# EAGLE design mazeSolver (EAGLE 9.6.2)

## Sheet 1 of 4
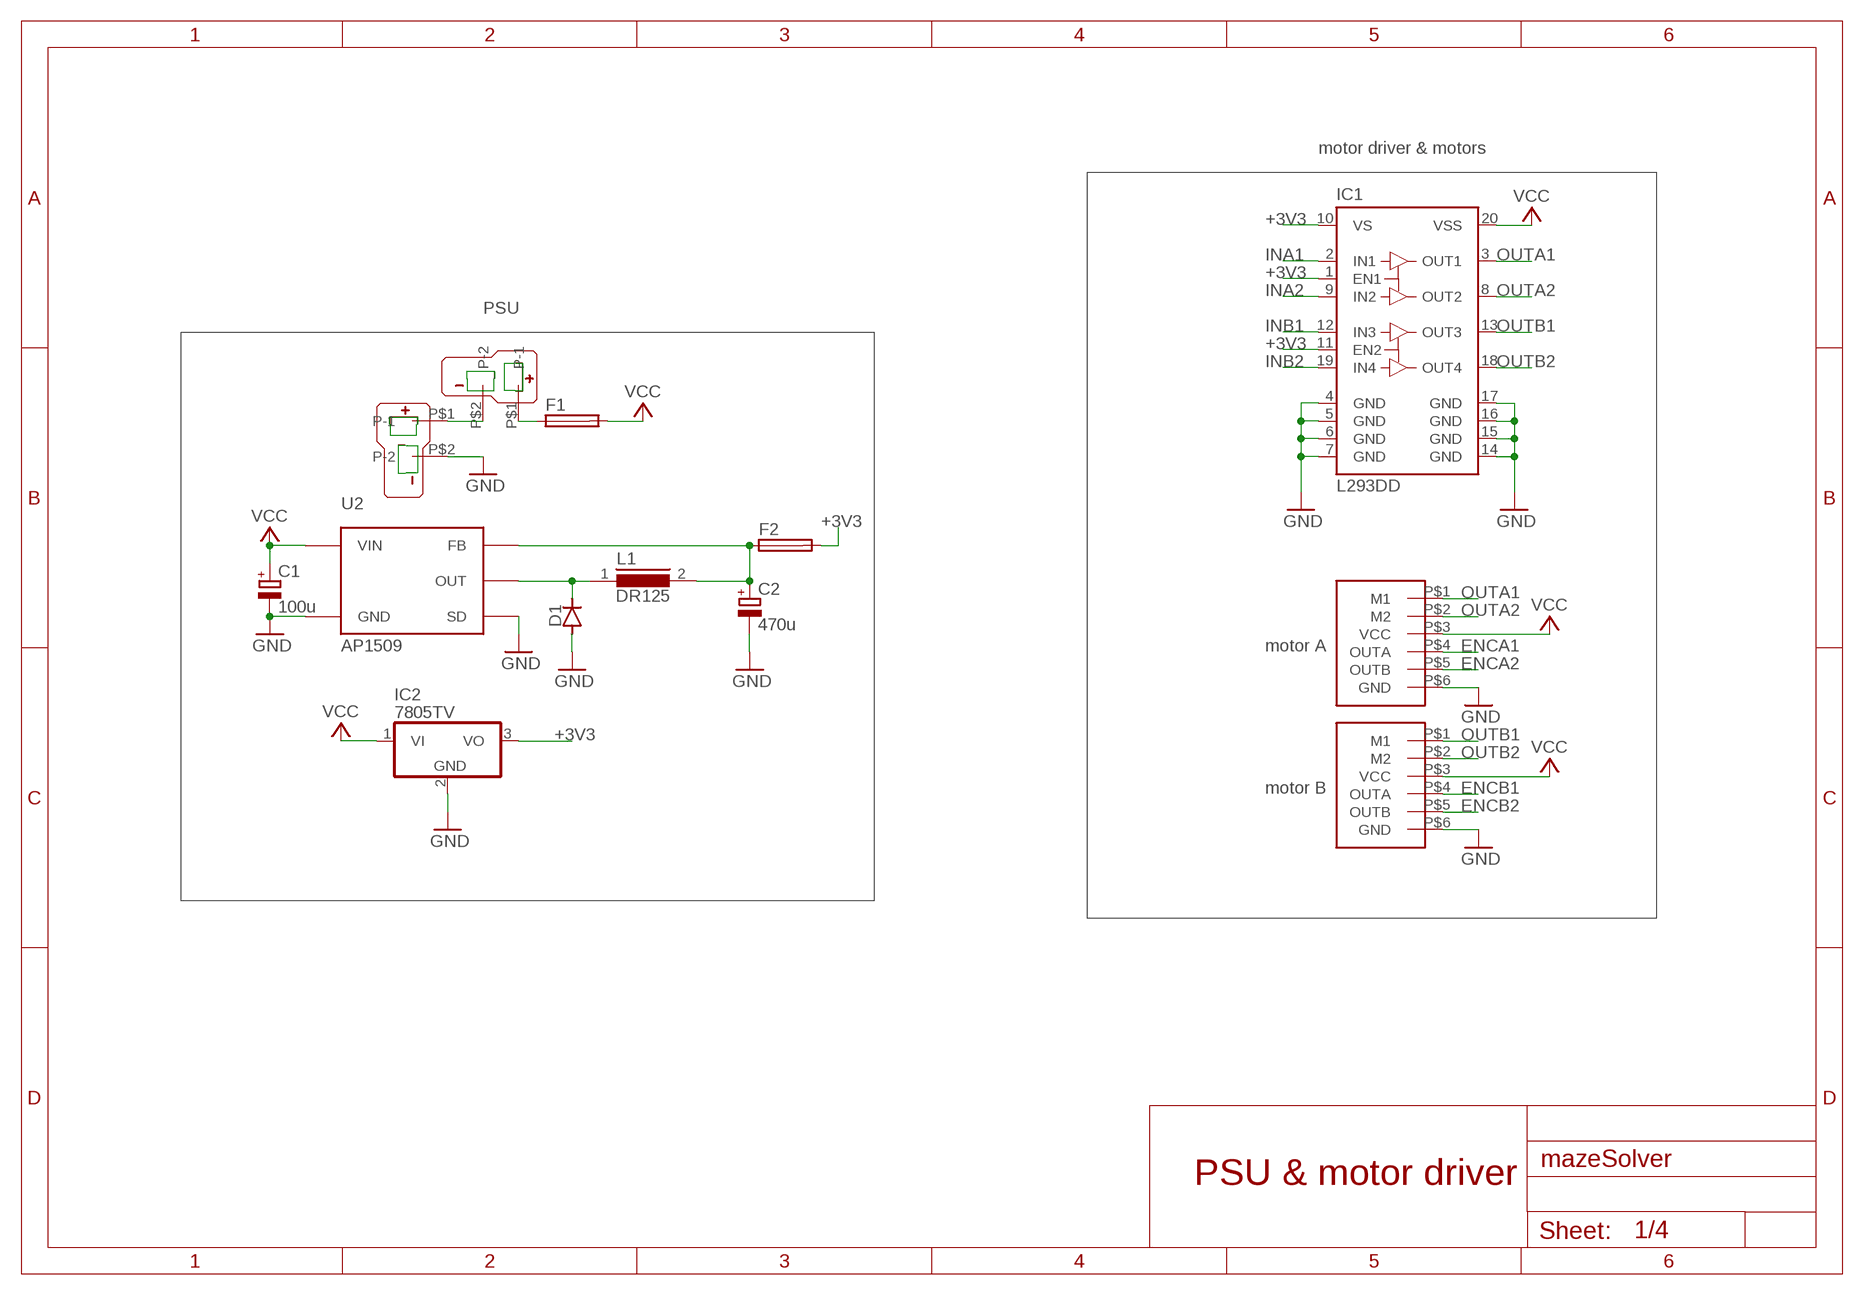
[diagram p0: schematic, sheet 1]

### Parts
C1  100u  CPOL-EU140CLH-0810  [140CLH-0810]
C2  470u  CPOL-EU140CLH-0810  [140CLH-0810]
D1  DIODE-DO214AC  [DO214AC]
F1  195591812  [C1812K]
F2  195591206  [C1206K]
IC1  L293DD  [SO20]
IC2  7805TV  [TO220V]
L1  DR125  [DR125]
U2  AP1509-SOP8L  [SOP-8L]
U$1  T-PLUG_CONNECTOR  [T_PLUG_CONNECTOR]
U$2  POLOLU_ENCODER  [POLOLU_ENCODER]
U$3  POLOLU_ENCODER  [POLOLU_ENCODER]
U$9  T-PLUG_CONNECTOR  [T_PLUG_CONNECTOR]

### Nets
+3V3: F2.2 IC1.1(EN1) IC1.10(VS) IC1.11(EN2) IC2.3(VO) ; also sheet 2,3
ENCA1: U$2.P$4(OUTA) ; also sheet 2
ENCA2: U$2.P$5(OUTB) ; also sheet 2
ENCB1: U$3.P$4(OUTA) ; also sheet 2
ENCB2: U$3.P$5(OUTB) ; also sheet 2
GND: C1.- C2.- D1.A IC1.4(GND) IC1.5(GND) IC1.6(GND) IC1.7(GND) IC1.14(GND) IC1.15(GND) IC1.16(GND) IC1.17(GND) IC2.2(GND) U2.4(SD) U2.5(GND) U2.6(GND) U2.7(GND) U2.8(GND) U$1.P$2(P-2) U$2.P$6(GND) U$3.P$6(GND) ; also sheet 2,3
INA1: IC1.2(IN1) ; also sheet 2
INA2: IC1.9(IN2) ; also sheet 2
INB1: IC1.12(IN3) ; also sheet 2
INB2: IC1.19(IN4) ; also sheet 2
N$3: D1.C L1.1 U2.2(OUT)
N$17: U$1.P$1(P-1) U$9.P$2(P-2)
N$22: F1.1 U$9.P$1(P-1)
N$24: C2.+ F2.1 L1.2 U2.3(FB)
OUTA1: IC1.3(OUT1) U$2.P$1(M1)
OUTA2: IC1.8(OUT2) U$2.P$2(M2)
OUTB1: IC1.13(OUT3) U$3.P$1(M1)
OUTB2: IC1.18(OUT4) U$3.P$2(M2)
VCC: C1.+ F1.2 IC1.20(VSS) IC2.1(VI) U2.1(VIN) U$2.P$3(VCC) U$3.P$3(VCC)

### Notes on the sheet
- motor driver & motors
- PSU
- motor A
- motor B
- PSU & motor driver

## Sheet 2 of 4
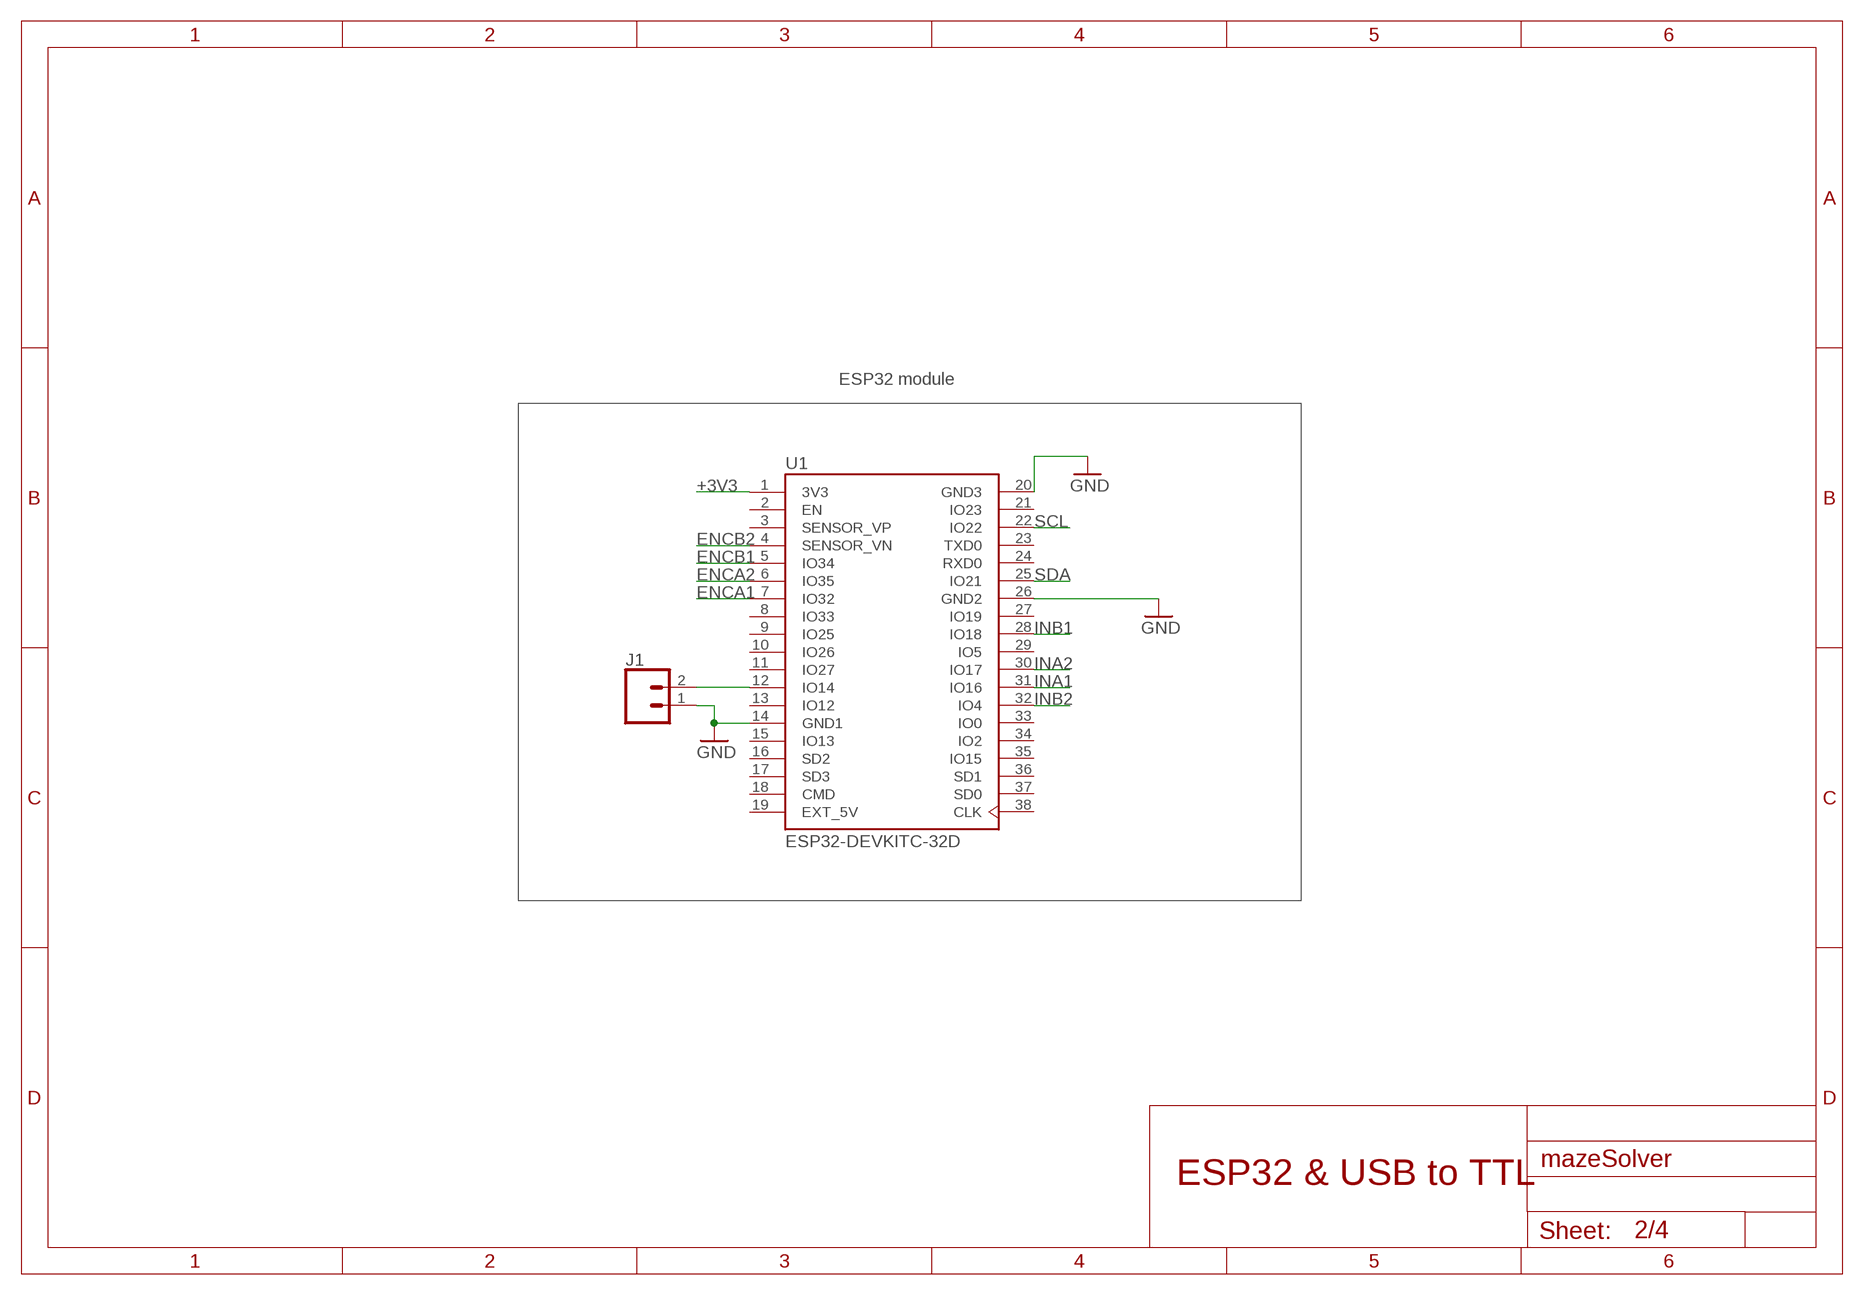
[diagram p1: schematic, sheet 2]

### Parts
J1  CONN_02  [1X02]
U1  ESP32-DEVKITC-32D  [MODULE_ESP32-DEVKITC-32D]

### Nets
+3V3: U1.1(3V3) ; also sheet 1,3
ENCA1: U1.7(IO32) ; also sheet 1
ENCA2: U1.6(IO35) ; also sheet 1
ENCB1: U1.5(IO34) ; also sheet 1
ENCB2: U1.4(SENSOR_VN) ; also sheet 1
GND: J1.1 U1.14(GND1) U1.20(GND3) U1.26(GND2) ; also sheet 1,3
INA1: U1.31(IO16) ; also sheet 1
INA2: U1.30(IO17) ; also sheet 1
INB1: U1.28(IO18) ; also sheet 1
INB2: U1.32(IO4) ; also sheet 1
N$19: J1.2 U1.12(IO14)
SCL: U1.22(IO22) ; also sheet 3
SDA: U1.25(IO21) ; also sheet 3
Unconnected: U1.2(EN) U1.3(SENSOR_VP) U1.8(IO33) U1.9(IO25) U1.10(IO26) U1.11(IO27) U1.13(IO12) U1.15(IO13) U1.16(SD2) U1.17(SD3) U1.18(CMD) U1.21(IO23) U1.23(TXD0) U1.24(RXD0) U1.27(IO19) U1.29(IO5) U1.33(IO0) U1.34(IO2) U1.35(IO15) U1.36(SD1) U1.37(SD0) U1.38(CLK)

### Notes on the sheet
- ESP32 module
- ESP32 & USB to TTL

## Sheet 3 of 4
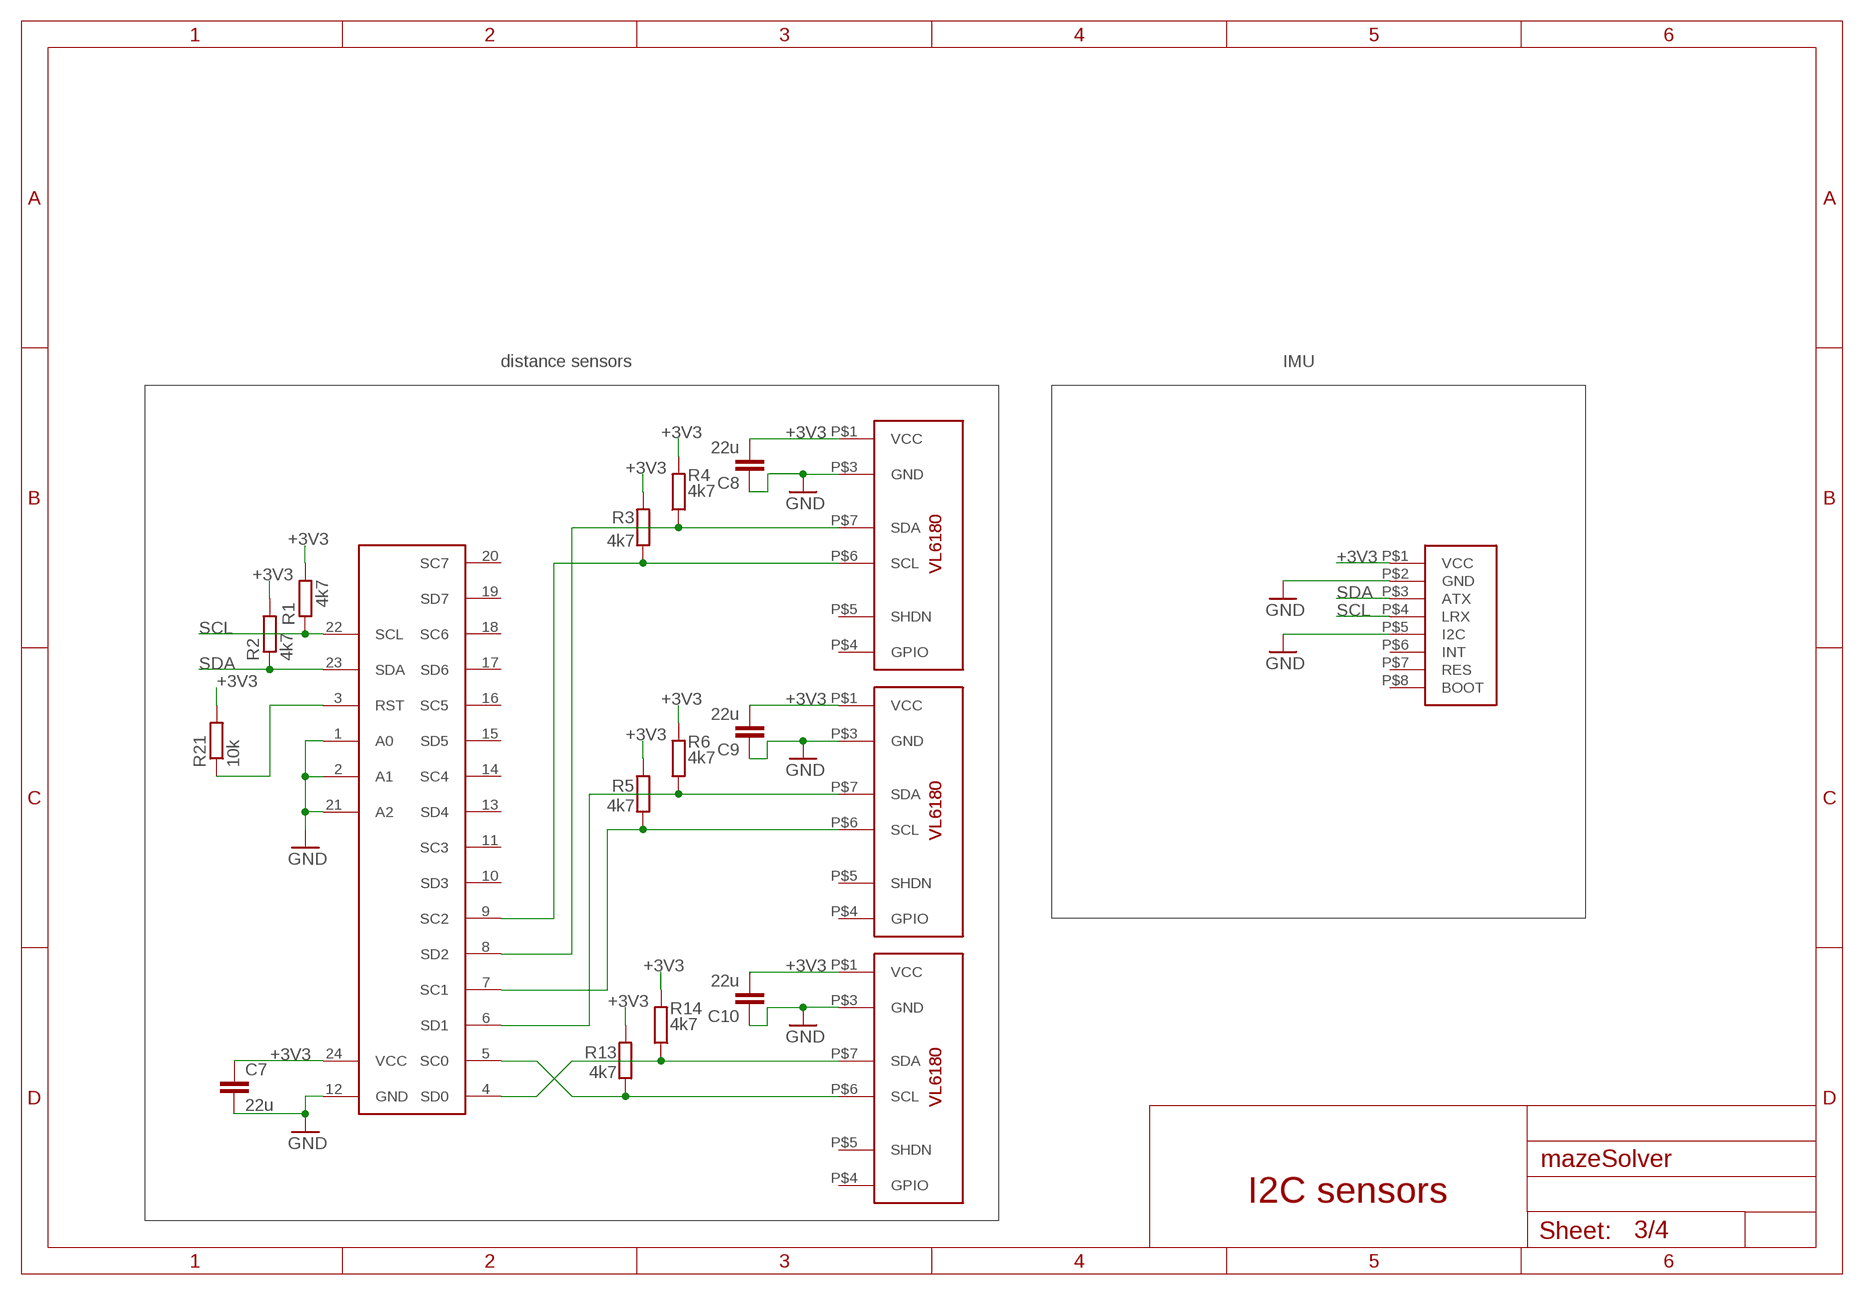
[diagram p2: schematic, sheet 3]

### Parts
C7  22u  C-EUC1206  [C1206]
C8  22u  C-EUC1206  [C1206]
C9  22u  C-EUC1206  [C1206]
C10  22u  C-EUC1206  [C1206]
R1  4k7  R-EU_R1206  [R1206]
R2  4k7  R-EU_R1206  [R1206]
R3  4k7  R-EU_R1206  [R1206]
R4  4k7  R-EU_R1206  [R1206]
R5  4k7  R-EU_R1206  [R1206]
R6  4k7  R-EU_R1206  [R1206]
R13  4k7  R-EU_R1206  [R1206]
R14  4k7  R-EU_R1206  [R1206]
R21  10k  R-EU_R1206  [R1206]
U$4  TDA9548  [SOIC24L]
U$5  VL6180X  [VL6180X]
U$6  VL6180X  [VL6180X]
U$7  VL6180X  [VL6180X]
U$8  BNO055  [BNO055]

### Nets
+3V3: C7.1 C8.1 C9.1 C10.1 R1.2 R2.2 R3.2 R4.2 R5.2 R6.2 R13.2 R14.2 R21.2 U$4.24(VCC) U$5.P$1(VCC) U$6.P$1(VCC) U$7.P$1(VCC) U$8.P$1(VCC) ; also sheet 1,2
GND: C7.2 C8.2 C9.2 C10.2 U$4.1(A0) U$4.2(A1) U$4.12(GND) U$4.21(A2) U$5.P$3(GND) U$6.P$3(GND) U$7.P$3(GND) U$8.P$2(GND) U$8.P$5(I2C) ; also sheet 1,2
N$1: R13.1 U$4.5(SC0) U$7.P$6(SCL)
N$2: R14.1 U$4.4(SD0) U$7.P$7(SDA)
N$4: R6.1 U$4.6(SD1) U$6.P$7(SDA)
N$5: R5.1 U$4.7(SC1) U$6.P$6(SCL)
N$6: R4.1 U$4.8(SD2) U$5.P$7(SDA)
N$7: R3.1 U$4.9(SC2) U$5.P$6(SCL)
N$25: R21.1 U$4.3(RST)
SCL: R1.1 U$4.22(SCL) U$8.P$4(LRX) ; also sheet 2
SDA: R2.1 U$4.23(SDA) U$8.P$3(ATX) ; also sheet 2
Unconnected: U$4.10(SD3) U$4.11(SC3) U$4.13(SD4) U$4.14(SC4) U$4.15(SD5) U$4.16(SC5) U$4.17(SD6) U$4.18(SC6) U$4.19(SD7) U$4.20(SC7) U$5.P$4(GPIO) U$5.P$5(SHDN) U$6.P$4(GPIO) U$6.P$5(SHDN) U$7.P$4(GPIO) U$7.P$5(SHDN) U$8.P$6(INT) U$8.P$7(RES) U$8.P$8(BOOT)

### Notes on the sheet
- distance sensors | IMU
- I2C sensors

## Sheet 4 of 4

## Power pins joined to a net without a drawn wire
EXT_5V: U1.19(EXT_5V)

## Library data of the parts
C1 = rcl:CPOL-EU: POLARIZED CAPACITOR, European symbol; MF: RUBYCON; MPN: 100YXF100MEFC12.5X20; OC_FARNELL: 1144642; SPICEPREFIX: C
C2 = rcl:CPOL-EU: POLARIZED CAPACITOR, European symbol; OC_FARNELL: unknown; SPICEPREFIX: C
C7-C10 = rcl:C-EU: CAPACITOR, European symbol; OC_FARNELL: unknown; SPICEPREFIX: C
D1 = diode:DIODE-: DIODE; OC_FARNELL: unknown
F1 F2 = polyfuse:19559: FUSE HOLDER TR5, Wickmann
IC1 = st-microelectronics:L293DD: PUSH-PULL FOUR CHANNEL DRIVER WITH DIODES Source: http://www.st.com/stonline/books/pdf/docs/1330.pdf; OC_FARNELL: unknown
IC2 = linear:78*: Positive VOLTAGE REGULATOR Source: http://cache.national.com/ds/LM/LM78L05.pdf http://www.fairchildsemi.com/ds/LM/LM7805.pdf; OC_FARNELL: unknown
J1 = SparkFun-Connectors:CONN_02: Multi connection point. Often used as Generic Header-pin footprint for 0.1 inch spaced/style header connections On any of the 0.1 inch spaced packages, you can populate with these: Break Away Headers - Straight <https://www.sparkfun.com/products/116> (PRT-00116) Break Away Male Headers - Right Angle <https://www.sparkfun.com/products/553> (PRT-00553) Female Headers <https://www.sparkfun.com/products/115> (PRT-00115) Break Away Headers - Machine Pin <https://www.sparkfun.com/products/117> (PRT-00117) Break Away Female Headers - Swiss Machine Pin <https://www.sparkfun.com/products/743> (PRT-00743) For SCREWTERMINALS and SPRING TERMINALS visit here: Screw Terimnals on SparkFun.com <https://www.sparkfun.com/search/results?term=Screw+Terminals> (5mm/3.5mm/2.54mm spacing) This device is also useful as a general connection point to wire up your design to another part of your project. Our various solder wires solder well into these plated through hole pads. Hook-Up Wire - Assortment (Stranded, 22 AWG) <https://www.sparkfun.com/products/11375> (PRT-11375) Hook-Up Wire - Assortment (Solid Core, 22 AWG) <https://www.sparkfun.com/products/11367> (PRT-11367) View the entire wire category on our website here <https://www.sparkfun.com/categories/141> Special notes: Molex polarized connector foot print use with: PRT-08233 with associated crimp pins and housings. 2.54_SCREWTERM for use with PRT-10571. 3.5mm Screw Terminal footprints for PRT-08084 5mm Screw Terminal footprints for use with PRT-08432; OC_FARNELL: unknown
L1 = inductors:DR125: High Power Density, High Efficiency, Shielded Inductors Source: coiltronics_dr_series.pdf; OC_FARNELL: unknown; SPICEPREFIX: L
R1-R6 R13 R14 R21 = rcl:R-EU_: RESISTOR, European symbol; OC_FARNELL: unknown; SPICEPREFIX: R
U1 = ESP32-DEVKITC-32D:ESP32-DEVKITC-32D: Eval Board For Esp-Wroom-32 Check prices <https://pricing.snapeda.com/parts/ESP32-DEVKITC-32D/Espressif%20Systems/view-part?ref=eda>; AVAILABILITY: Warning; DESCRIPTION: EVAL BOARD FOR ESP-WROOM-32; MF: Espressif Systems; MP: ESP32-DEVKITC-32D; PACKAGE: None; PRICE: None; PURCHASE-URL: https://pricing.snapeda.com/search/part/ESP32-DEVKITC-32D/?ref=eda
U2 = kanflo:AP1509: AP1509 150kHz 2A PWM Buck DC/DC Converter; OC_FARNELL: unknown
U$1 U$9 = con-T-plug:T-PLUG_CONNECTOR; OC_FARNELL: unknown
U$2 = pololu_encoder:POLOLU_ENCODER
U$3 = pololu_encoder:POLOLU_ENCODER; OC_FARNELL: unknown
U$4 = tda9548:TDA9548; OC_FARNELL: unknown
U$5-U$7 = vl6180x:VL6180X; OC_FARNELL: unknown
U$8 = bno055:BNO055

## Board
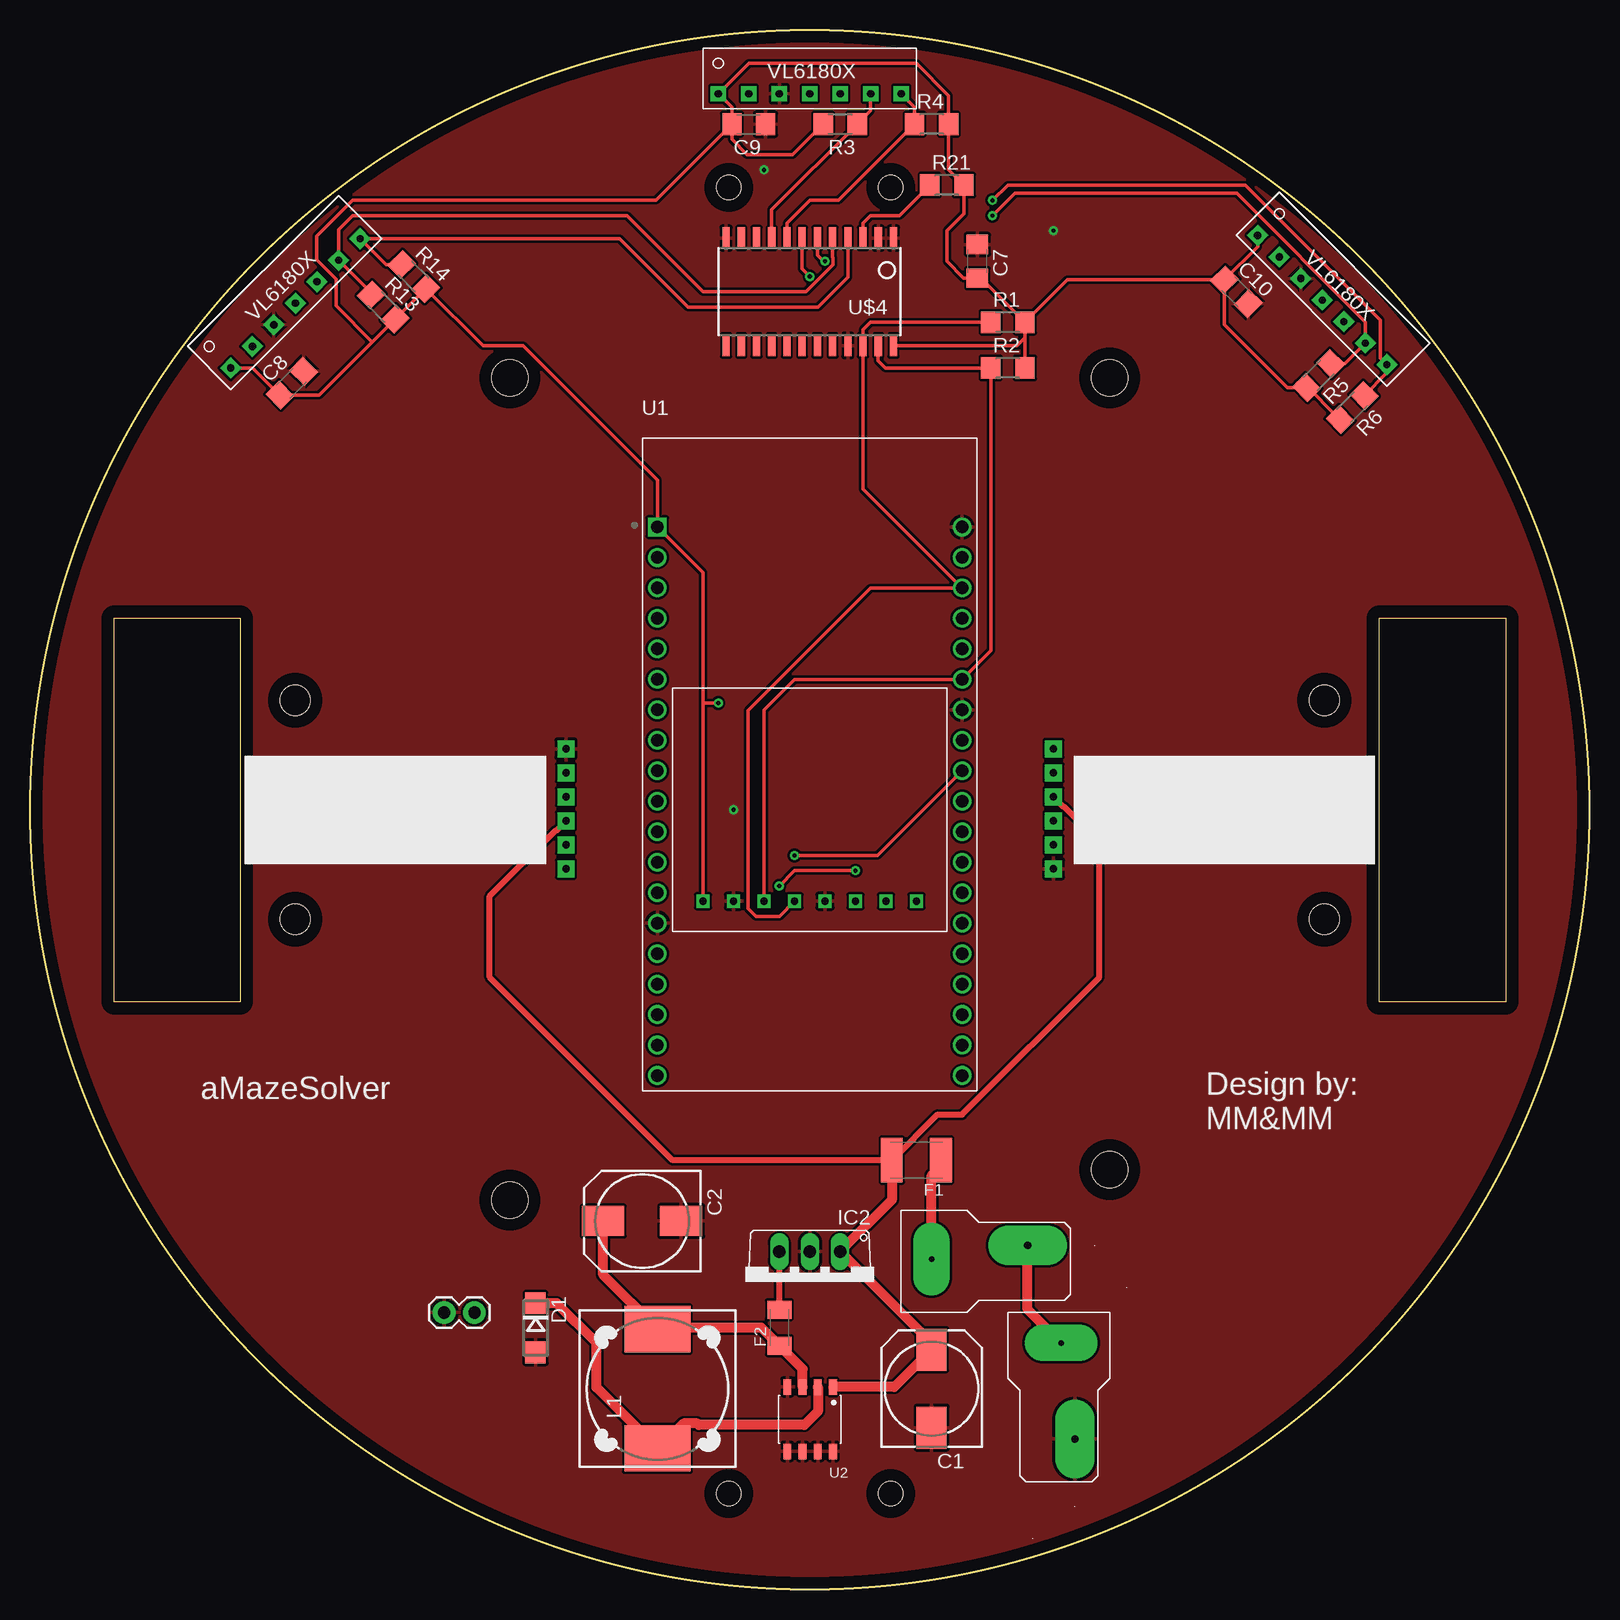
[diagram p3: board, top side]
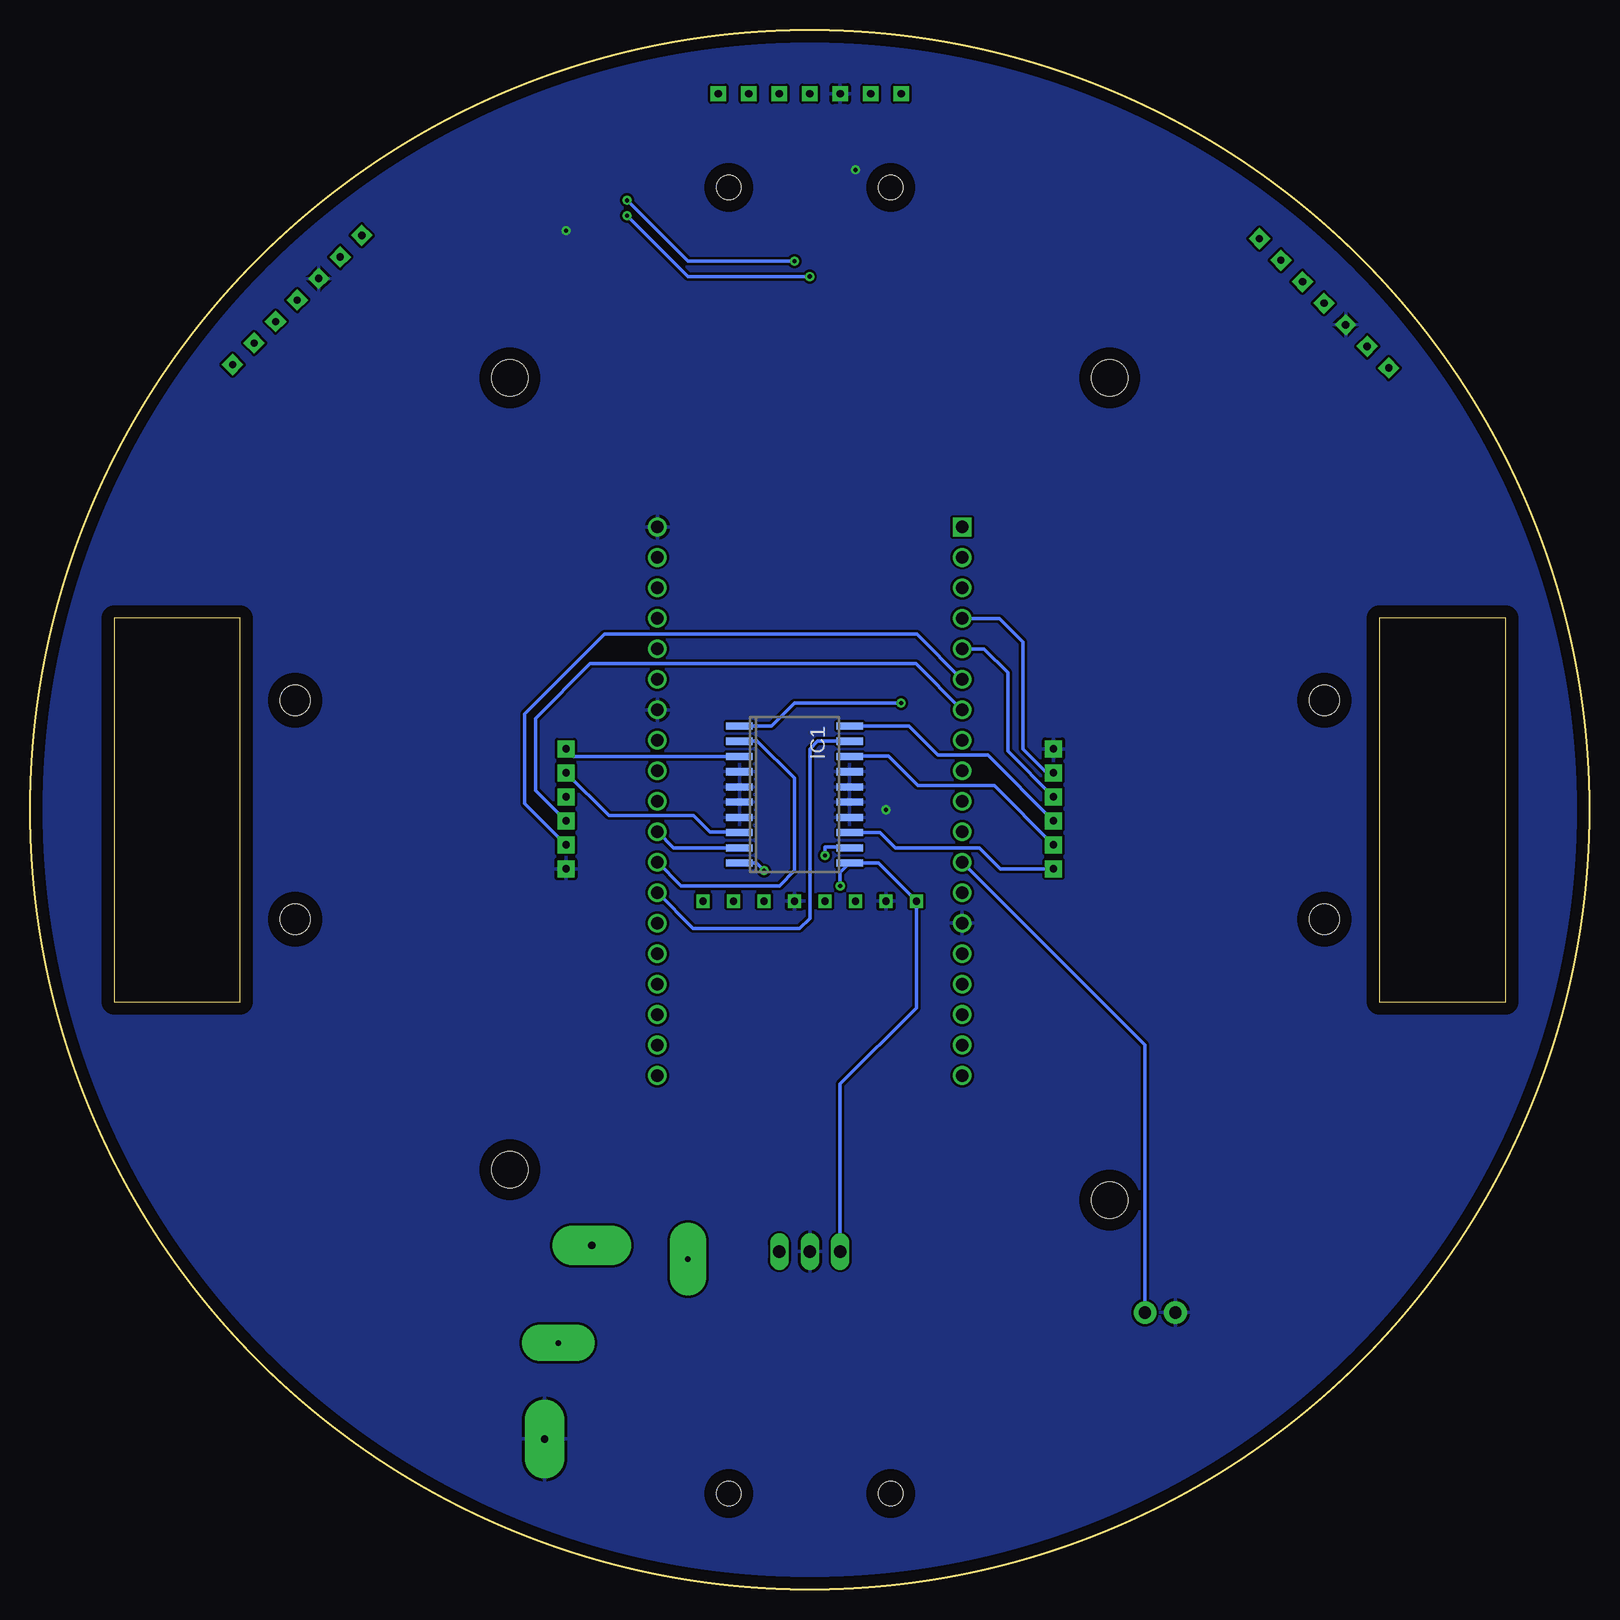
[diagram p4: board, bottom side, seen from below]

Size 130 x 130 mm. Coordinates in mm from the lower left corner, seen from the top.
Outline: 17.5,81 17.5,49 7,49 7,81 17.5,81
Outline: 123,81 123,49 112.5,49 112.5,81 123,81
Outline: circle at 65,65 radius 65
Copper layers (1*16): Top 0.035mm / dielectric 1.5mm / Bottom 0.035mm
Design rules "default *": minimum track width 6mil, minimum drill 0.35mm, track to track 0.2mm, track to pad 0.2mm, pad to pad 6mil, via to via 6mil, smd to smd 6mil, copper to edge 40mil, drill to drill 6mil, minimum pad ring 10mil, minimum via ring 8mil, stop-mask expansion 4mil, vias tented up to drill 0mil, thermal gap 10mil
Holes 2 mm at 58.25,8 71.75,8 58.25,116.87 71.75,116.87
Holes 2.5 mm at 22.1,74.12 22.1,55.88 107.9,74.12 107.9,55.88
Holes 3 mm at 40,101 90,101 90,35 40,32.46

### Footprints (pad centres in the part's own frame; a part is rotated, then mirrored left to right if it is on the bottom)
140CLH-0810 = smd 3.5 x 2.5: + 3.25,0; - -3.25,0
C1206 = smd 1.6 x 1.8: 1 -1.4,0; 2 1.4,0
DO214AC = smd 1.8 x 1.7: A 2.05,0; C -2.05,0
C1812K = smd 1.8 x 3.7: 1 -2.05,0; 2 2.05,0
C1206K = smd 1.5 x 2: 1 -1.5,0; 2 1.5,0
SO20 = smd 0.6 x 2.2: 1 -5.715,-4.6; 2 -4.445,-4.6; 3 -3.175,-4.6; 4 -1.905,-4.6; 5 -0.635,-4.6; 6 0.635,-4.6; 7 1.905,-4.6; 8 3.175,-4.6; 9 4.445,-4.6; 10 5.715,-4.6; 11 5.715,4.6; 12 4.445,4.6; 13 3.175,4.6; 14 1.905,4.6; 15 0.635,4.6; 16 -0.635,4.6; 17 -1.905,4.6; 18 -3.175,4.6; 19 -4.445,4.6; 20 -5.715,4.6
TO220V = drill 1.016 long: 1 -2.54,-2.54; 2 0,-2.54; 3 2.54,-2.54
1X02 = drill 1.016 pad 1.88: 1 0,0; 2 2.54,0
DR125 = smd 3.85 x 5.5: 1 -4.975,0; 2 4.975,0
R1206 = smd 1.6 x 1.803: 1 -1.422,0; 2 1.422,0
MODULE_ESP32-DEVKITC-32D = drill 1.04 square: 1 -12.7,19.76 | drill 1.04: 2 -12.7,17.22; 3 -12.7,14.68; 4 -12.7,12.14; 5 -12.7,9.6; 6 -12.7,7.06; 7 -12.7,4.52; 8 -12.7,1.98; 9 -12.7,-0.56; 10 -12.7,-3.1; 11 -12.7,-5.64; 12 -12.7,-8.18; 13 -12.7,-10.72; 14 -12.7,-13.26; 15 -12.7,-15.8; 16 -12.7,-18.34; 17 -12.7,-20.88; 18 -12.7,-23.42; 19 -12.7,-25.96; 20 12.7,19.76; 21 12.7,17.22; 22 12.7,14.68; 23 12.7,12.14; 24 12.7,9.6; 25 12.7,7.06; 26 12.7,4.52; 27 12.7,1.98; 28 12.7,-0.56; 29 12.7,-3.1; 30 12.7,-5.64; 31 12.7,-8.18; 32 12.7,-10.72; 33 12.7,-13.26; 34 12.7,-15.8; 35 12.7,-18.34; 36 12.7,-20.88; 37 12.7,-23.42; 38 12.7,-25.96
SOP-8L = smd 0.65 x 1.3: 1 -1.94,-2.69; 2 -0.67,-2.69; 3 0.6,-2.69; 4 1.87,-2.69; 5 1.87,2.69; 6 0.6,2.69; 7 -0.67,2.69; 8 -1.94,2.69
T_PLUG_CONNECTOR = drill 0.45 pad 3.048 long: P$1 2.54,4.445 | drill 0.6 pad 3.302 long: P$2 10.541,5.588
POLOLU_ENCODER = drill 0.6 pad 1.422 square: P$1 0,0; P$2 2,0; P$3 4,0; P$4 6,0; P$5 8,0; P$6 10,0
SOIC24L = smd 0.6 x 1.8: 1 -6.985,-4.475; 2 -5.715,-4.475; 3 -4.445,-4.475; 4 -3.175,-4.475; 5 -1.905,-4.475; 6 -0.635,-4.475; 7 0.635,-4.475; 8 1.905,-4.475; 9 3.175,-4.475; 10 4.445,-4.475; 11 5.715,-4.475; 12 6.985,-4.475; 13 6.985,4.475; 14 5.715,4.475; 15 4.445,4.475; 16 3.175,4.475; 17 1.905,4.475; 18 0.635,4.475; 19 -0.635,4.475; 20 -1.905,4.475; 21 -3.175,4.475; 22 -4.445,4.475; 23 -5.715,4.475; 24 -6.985,4.475
VL6180X = drill 0.6 pad 1.27 square: P$1 0,0; P$2 2.54,0; P$3 5.08,0; P$4 7.62,0; P$5 10.16,0; P$6 12.7,0; P$7 15.24,0
BNO055 = drill 0.6 square: P$1 -10.16,-2.54; P$2 -7.62,-2.54; P$3 -5.08,-2.54; P$4 -2.54,-2.54; P$5 0,-2.54; P$6 2.54,-2.54; P$7 7.62,-2.54; P$8 5.08,-2.54

### Placement (x,y rotation side)
C1  75.16,16.74 90 top
C2  51.03,30.71 180 top
C7  78.97,110.72 90 top
C8  21.82,100.56 45 top
C9  59.92,122.15 0 top
C10  100.56,108.18 315 top
D1  42.14,21.82 270 top
F1  73.89,35.79 180 top
F2  62.46,21.82 90 top
IC1  66.27,66.27 270 bottom
IC2  65,25.63 180 top
J1  34.52,23.09 0 top
L1  52.3,16.74 90 top
R1  81.51,105.64 0 top
R2  81.51,101.83 0 top
R3  67.54,122.15 180 top
R4  75.16,122.15 0 top
R5  107.42,101.19 225 top
R6  110.21,98.53 225 top
R13  29.44,106.91 315 top
R14  31.98,109.45 315 top
R21  76.43,117.07 0 top
U1  65,68.81 0 top
U2  65,14.2 180 top
U$1  81.51,23.09 270 top
U$2  85.32,70.08 270 top
U$3  44.68,60.08 90 top
U$4  65,108.18 180 top
U$5  57.38,124.69 0 top
U$6  102.34,112.88 315 top
U$7  16.74,101.83 45 top
U$8  66.27,59.92 0 top
U$9  72.62,23.09 0 top

### Tracks (layer width: path | path; a pad name or v marks a point on that pad's centre or on a via)
+3V3  (via drill 0.35)
  Top 0.305: U$6.P$1 102.34,111.94 C10.1 | R6.2 106.17,100.56 105.64,100.56 106.01,100.19 R5.2 104.8,100.19 99.57,105.42 C10.1 | C9.1 58.52,123.55 U$5.P$1 59.92,127.23 73.89,127.23 76.58,124.54 R4.2 76.58,118.34 R21.2 77.85,114.68 76.43,113.26 76.43,110.72 77.83,109.32 C7.1 79.25,109.32 R1.2 | C9.1 58.52,120.88 59.79,119.61 63.58,119.61 R3.2 | R2.2 82.93,104.37 | 82.93,104.37 R1.2 | 82.93,104.37 82.27,103.7 U$4.24 | C10.1 86.46,109.17 R1.2 | U$7.P$1 18.57,101.83 C8.1 24.11,99.57 28.54,104 | 28.54,104 R13.2 R14.2 37.76,103.67 41.11,103.67 52.3,92.47 U1.1 56.11,84.76 56.11,73.89 | U$8.P$1 56.11,73.89 | 28.54,104 25.53,107.01 25.53,109.24 23.91,110.86 23.91,112.81 26.9,115.8 52.17,115.8 C9.1 | v57.38,73.89 56.11,73.89 | v62.46,58.65 63.73,59.92 v68.81,59.92
  Top 0.508: F2.2 IC2.3
  Bottom 0.305: IC1.1 68.17,71.98 66.27,73.89 v57.38,73.89 | v62.46,58.65 62.46,59.77 IC1.11 59.28,60.55 U$8.P$1 56.11,48.49 62.46,42.14 IC2.3 | v68.81,59.92 69.44,60.55 IC1.10
ENCA1
  Bottom 0.305: U$2.P$4 87.86,66.62 87.86,72.62 83.31,77.17 56.14,77.17 U1.7
ENCA2
  Bottom 0.305: U$2.P$5 88.76,65.52 88.76,72.99 82.11,79.64 56.07,79.64 U1.6
ENCB1
  Bottom 0.305: U$3.P$4 48.49,69.89 48.49,76.43 50.47,78.41 U1.5
ENCB2
  Bottom 0.305: U$3.P$5 45.22,68.08 47.22,70.08 47.22,78.97 49.2,80.95 U1.4
GND  (via drill 0.35)
  other vias: 61.19,118.34 85.32,113.26 58.65,65
  pour Bottom: -3.58,137.39 123.42,137.39 150.09,110.72 150.09,15.47 123.42,-11.2 1.5,-11.2 -23.9,14.2 -23.9,117.07
  pour Top: -21.36,115.8 -2.31,134.85 122.15,134.85 147.55,109.45 147.55,96.75 147.55,16.74 123.42,-7.39 1.5,-7.39 -21.36,15.47
INA1
  Bottom 0.305: IC1.2 70.84,70.75 69.39,70.75 66.27,67.63 66.27,59.92 67.54,58.65 75.72,58.65 U1.31
INA2
  Bottom 0.305: U1.30 76.36,61.83 IC1.9
INB1  (via drill 0.35)
  Top 0.305: U1.28 70.64,61.19 v63.73,61.19
  Bottom 0.305: v63.73,61.19 63.73,61.88 61.73,61.88 IC1.12
INB2
  Bottom 0.305: U1.32 74.72,55.11 65.85,55.11 65,55.95 65,70.08 64.36,70.72 IC1.19
N$1
  Top 0.305: R13.1 28.43,108.1 U$7.P$6 25.72,113.35 26.9,114.53 49.76,114.53 56.11,108.18 64.7,108.18 66.95,110.44 66.95,111 66.91,111.05 U$4.5
N$2
  Top 0.305: R14.1 29.67,110.46 U$7.P$7 49.14,112.61 54.84,106.91 65.68,106.91 68.17,109.41 U$4.4
N$3
  Top 0.305: L1.1 52.94,11.13 52.94,11.02
  Top 0.813: U2.2 65.67,14.86 65.68,14.85 64.54,13.71 55.74,13.71 55.61,13.85 54.49,13.85 52.3,11.66 52.94,11.02 | L1.1 47.22,16.84 47.22,20.55 43.9,23.87 D1.C
N$4  (via drill 0.35)
  Top 0.305: R6.1 113.11,101.43 U$6.P$7 112.57,102.65 112.57,105.82 101.31,117.07 81.51,117.07 v80.24,115.8 | v66.27,110.72 66.13,110.72 65.64,111.22 U$4.6
  Bottom 0.305: v80.24,115.8 75.16,110.72 v66.27,110.72
N$5  (via drill 0.35)
  Top 0.305: R5.1 109.62,102.2 U$6.P$6 111.32,105.65 100.59,116.38 82.09,116.38 v80.24,114.53 | v65,109.45 64.36,110.09 U$4.7
  Bottom 0.305: v80.24,114.53 75.16,109.45 v65,109.45
N$6
  Top 0.305: U$5.P$7 73.74,123.57 R4.1 67.39,115.8 65,115.8 63.09,113.9 U$4.8
N$7
  Top 0.305: U$5.P$6 70.08,123.27 R3.1 61.83,115.01 U$4.9
N$17
  Top 0.813: U$1.P$1 83.16,23.34 U$9.P$2
N$19
  Bottom 0.305: U1.12 37.06,45.39 J1.2
N$22
  Top 0.813: U$9.P$1 75.16,34.52 76.43,35.79 F1.1
N$24
  Top 0.813: U2.3 64.4,18.38 F2.1 60.96,21.82 51.03,21.82 51.13,21.72 L1.2 47.78,26.23 C2.+
N$25
  Top 0.305: R21.1 73.92,115.98 73.92,115.97 72.48,114.53 70.07,114.53 69.44,113.9 U$4.3
OUTA1
  Bottom 0.305: U$2.P$1 84.69,69.44 IC1.3
OUTA2
  Bottom 0.305: IC1.8 70.9,63.13 73.32,63.13 74.7,64.51 81.75,64.51 U$2.P$2
OUTB1
  Bottom 0.305: U$3.P$1 49.12,60.08 50.86,61.83 57.86,61.83 59.13,63.09 IC1.13
OUTB2
  Bottom 0.305: U$3.P$2 49.61,67.01 55.96,67.01 58.42,69.47 61.65,69.47 IC1.18
SCL
  Top 0.305: R1.1 70.08,105.64 69.44,105 U$4.22 69.44,91.75 U1.22 70.08,83.49 59.87,73.28 59.87,56.77 60.53,56.11 62.46,56.11 U$8.P$4
SDA
  Top 0.305: U$4.23 70.69,103.68 70.69,102.43 71.29,101.83 R2.1 80.09,78.26 U1.25 63.73,75.87 61.19,73.33 U$8.P$3
VCC
  Top 0.508: U$2.P$3 86.16,65.25 86.22,65.25 89.13,62.33 89.13,51.03 77.7,39.6 75.65,39.6 F1.2 53.57,35.79 38.33,51.03 38.33,57.8 43.78,63.24 43.84,63.24 U$3.P$3
  Top 0.813: F1.2 71.84,32.47 IC2.1 75.16,20.55 C1.+ 72.06,16.89 U2.1
  Bottom 0.305: IC1.20 56.74,71.98 54.31,69.55 50.14,69.55 U$3.P$3

### Text on the board
tNames: aMazeSolver | Design by: / MM&MM